# Altium project MG_V4(1).PrjPcb
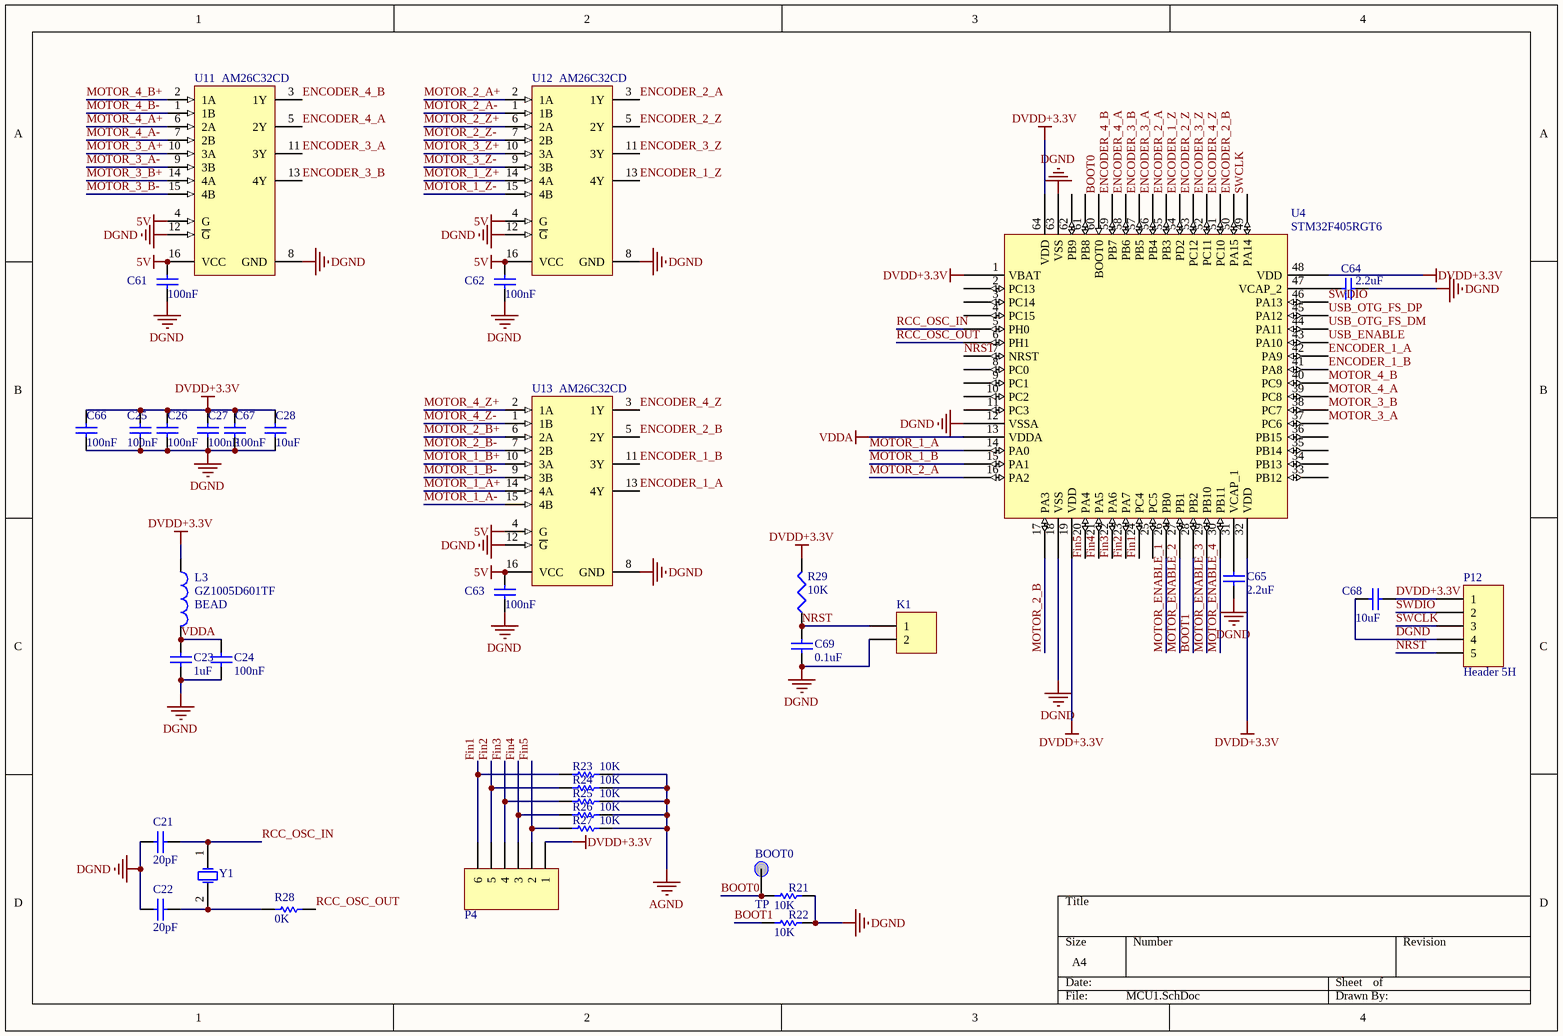
[diagram p0: MCU1.SchDoc]
3 sheets, 89 parts. Net scope: global (net labels, ports and power ports of the same name join across sheets).
Board file: MG_V4(1).PcbDoc
Sheets:
  MCU1.SchDoc
  MotorDrive1.SchDoc
  PowerSupply1.SchDoc

## Sheet MCU1.SchDoc
size A4

### Parts
BOOT0  TP  [TestPort]
C21  20pF  [0402]
C22  20pF  [0402]
C23  1uF  [1608[0603]]
C24  100nF  [1608[0603]]
C25  100nF  [1608[0603]]
C26  100nF  [1608[0603]]
C27  100nF  [1608[0603]]
C28  10uF  [1608[0603]]
C61  100nF  [1608[0603]]
C62  100nF  [1608[0603]]
C63  100nF  [1608[0603]]
C64  2.2uF  [1608[0603]]
C65  2.2uF  [1608[0603]]
C66  100nF  [1608[0603]]
C67  100nF  [1608[0603]]
C68  10uF  [1608[0603]]
C69  0.1uF  [1608[0603]]
K1  Header 2  [Button]  (value not drawn)
L3  GZ1005D601TF  [0402-A]
P4  Header 6  [HDR1X6]  (value not drawn)
P12  Header 5H  [HDR1X5H]
R21  10K  [J1-0603]
R22  10K  [J1-0603]
R23  10K  [RES[0402]]
R24  10K  [RES[0402]]
R25  10K  [RES[0402]]
R26  10K  [RES[0402]]
R27  10K  [RES[0402]]
R28  0K  [J1-0603]
R29  10K  [J1-0603]
U4  STM32F405RGT6  [STM32F405RGT6]
U11  AM26C32CD  [D16_L]
U12  AM26C32CD  [D16_L]
U13  AM26C32CD  [D16_L]
Y1  XTAL  [Crystal_HCM49]  (value not drawn)

### Nets
5V: C61.2 C62.2 C63.2 U11.4(G) U11.16(VCC) U12.4(G) U12.16(VCC) U13.4(G) U13.16(VCC)
AGND: R23.2 R24.2 R25.2 R26.2 R27.2
DGND: C21.1 C22.1 C23.1 C24.1 C25.1 C26.1 C27.1 C28.1 C61.1 C62.1 C63.1 C64.2 C65.1 C66.1 C67.1 C68.1 C69.1 K1.2 P12.4 R21.2 R22.2 U4.12(VSSA) U4.18(VSS) U4.63(VSS) U11.8(GND) U11.12(~{G}) U12.8(GND) U12.12(~{G}) U13.8(GND) U13.12(~{G})
DVDD+3.3V: C25.2 C26.2 C27.2 C28.2 C66.2 C67.2 C68.2 L3.1 P4.1 P12.1 R29.2 U4.1(VBAT) U4.19(VDD) U4.32(VDD) U4.48(VDD) U4.64(VDD)
VDDA: C23.2 C24.2 L3.2 U4.13(VDDA)
BOOT0: BOOT0.0 R21.1 U4.60(BOOT0)
BOOT1: R22.1 U4.28(PB2)
ENCODER_1_A: U4.42(PA9) U13.13(4Y)
ENCODER_1_B: U4.41(PA8) U13.11(3Y)
ENCODER_1_Z: U4.54(PD2) U12.13(4Y)
ENCODER_2_A: U4.55(PB3) U12.3(1Y)
ENCODER_2_B: U4.50(PA15) U13.5(2Y)
ENCODER_2_Z: U4.53(PC12) U12.5(2Y)
ENCODER_3_A: U4.56(PB4) U11.11(3Y)
ENCODER_3_B: U4.57(PB5) U11.13(4Y)
ENCODER_3_Z: U4.52(PC11) U12.11(3Y)
ENCODER_4_A: U4.58(PB6) U11.5(2Y)
ENCODER_4_B: U4.59(PB7) U11.3(1Y)
ENCODER_4_Z: U4.51(PC10) U13.3(1Y)
Fin1: P4.6 R23.1 U4.24(PC4)
Fin2: P4.5 R24.1 U4.23(PA7)
Fin3: P4.4 R25.1 U4.22(PA6)
Fin4: P4.3 R26.1 U4.21(PA5)
Fin5: P4.2 R27.1 U4.20(PA4)
MOTOR_1_A: U4.14(PA0)
MOTOR_1_A+: U13.14(4A)
MOTOR_1_A-: U13.15(4B)
MOTOR_1_B: U4.15(PA1)
MOTOR_1_B+: U13.10(3A)
MOTOR_1_B-: U13.9(3B)
MOTOR_1_Z+: U12.14(4A)
MOTOR_1_Z-: U12.15(4B)
MOTOR_2_A: U4.16(PA2)
MOTOR_2_A+: U12.2(1A)
MOTOR_2_A-: U12.1(1B)
MOTOR_2_B: U4.17(PA3)
MOTOR_2_B+: U13.6(2A)
MOTOR_2_B-: U13.7(2B)
MOTOR_2_Z+: U12.6(2A)
MOTOR_2_Z-: U12.7(2B)
MOTOR_3_A: U4.37(PC6)
MOTOR_3_A+: U11.10(3A)
MOTOR_3_A-: U11.9(3B)
MOTOR_3_B: U4.38(PC7)
MOTOR_3_B+: U11.14(4A)
MOTOR_3_B-: U11.15(4B)
MOTOR_3_Z+: U12.10(3A)
MOTOR_3_Z-: U12.9(3B)
MOTOR_4_A: U4.39(PC8)
MOTOR_4_A+: U11.6(2A)
MOTOR_4_A-: U11.7(2B)
MOTOR_4_B: U4.40(PC9)
MOTOR_4_B+: U11.2(1A)
MOTOR_4_B-: U11.1(1B)
MOTOR_4_Z+: U13.2(1A)
MOTOR_4_Z-: U13.1(1B)
MOTOR_ENABLE_1: U4.26(PB0)
MOTOR_ENABLE_2: U4.27(PB1)
MOTOR_ENABLE_3: U4.29(PB10)
MOTOR_ENABLE_4: U4.30(PB11)
NRST: C69.2 K1.1 P12.5 R29.1 U4.7(NRST)
RCC_OSC_IN: C21.2 U4.5(PH0) Y1.1(OSC1)
RCC_OSC_OUT: R28.2 U4.6(PH1)
SWCLK: P12.3 U4.49(PA14)
SWDIO: P12.2 U4.46(PA13)
USB_ENABLE: U4.43(PA10)
USB_OTG_FS_DM: U4.44(PA11)
USB_OTG_FS_DP: U4.45(PA12)
NetC22_2: C22.2 R28.1 Y1.2(OSC2)
NetC64_1: C64.1 U4.47(VCAP_2)
NetC65_2: C65.2 U4.31(VCAP_1)

Not connected (* = marked no-connect by the designer): U4 2(PC13) 3(PC14) 4(PC15) 8(PC0) 9(PC1) 10(PC2) 11(PC3) 25(PC5) 33(PB12) 34(PB13) 35(PB14) 36(PB15) 61(PB8) 62(PB9)

### Notes on the sheet
- (near L3) BEAD

### Library data of the parts
BOOT0 = TestPoint
C21-C28 C61-C69 = Cap: Capacitor; Published: 8-Jun-2000; LatestRevisionDate: 17-Jul-2002; LatestRevisionNote: Re-released for DXP Platform.; PackageReference: RAD-0.3; Publisher: Altium Limited; PackageDescription: Radial Cap, Thru-Hole; 2 Leads; 0.3 in Pin Spacing
  C21 C22: Value: 20pF
  C23: Value: 1uF
  C24-C27 C61-C63 C66 C67: Value: 100nF
  C28 C68: Value: 10uF
  C64 C65: Value: 2.2uF
  C69: Value: 0.1uF
K1 = Header 2: Header, 2-Pin; LatestRevisionDate: 17-Jul-2002; LatestRevisionNote: Re-released for DXP Platform.; Publisher: Altium Limited
L3 = Inductor: Code_IEC: 1005; Published: 8-Jun-2000; LatestRevisionDate: 29-May-2009; LatestRevisionNote: IPC-7351 Footprint Added.; PackageReference: 0402-A; Publisher: Altium Limited; PackageDescription: Chip Inductor; Code_JEITA: 0402
P4 = Header 6: Header, 6-Pin; LatestRevisionDate: 17-Jul-2002; LatestRevisionNote: Re-released for DXP Platform.; Publisher: Altium Limited
P12 = Header 5H: Header, 5-Pin, Right Angle; LatestRevisionDate: 17-Jul-2002; LatestRevisionNote: Re-released for DXP Platform.; Publisher: Altium Limited
R21-R28 = Res1: Resistor; Published: 8-Jun-2000; LatestRevisionDate: 17-Jul-2002; LatestRevisionNote: Re-released for DXP Platform.; PackageReference: AXIAL-0.3; Publisher: Altium Limited; PackageDescription: Axial Device, Thru-Hole; 2 Leads; 0.3 in Pin Spacing
  R21-R27: Value: 10K
  R28: Value: 0K
R29 = Res3: Resistor; Published: 8-Jun-2000; LatestRevisionDate: 29-May-2009; LatestRevisionNote: IPC-7351 Footprint Added.; PackageReference: J1-0603; Publisher: Altium Limited; PackageDescription: Chip Resistor; Value: 10K
U4 = STM32F405RGT6: IC MCU 32BIT 1MB FLASH 64LQFP
U11-U13 = AM26C32CD: Quadruple Differential Line Receiver, 0 TX / 4 RX, 5V, 0 to 70 degC, 16-Pin SOIC(D), Green (RoHS & no Sb/Br); Manufacturer: Texas Instruments; SubFamily: RS-422; Receivers Per Package: 4; ICC(Max)(mA): 15; Supply Voltage(s)(V): 5; ESD(kV): 2; Rating: Catalog; DatasheetVersion: SLLS104I; PackageVersion: revM, Jun-2011; PackageReference: D16; PackageDescription: 16-Pin Plastic Small Outline Integrated Circuit, 9.9 x 3.9 mm, Pitch 1.27 mm Pitch; PartNumber: AM26C32CD; Mounting Technology: Surface Mount; Eco-Plan: Green (RoHS & no Sb/Br); # of TX/RX: 0 TX / 4 RX; Footprint: AM26LS32; Code_JEDEC: MS-012AC; ComponentLink1Description: Datasheet; ComponentLink1URL: http://www.ti.com/general/docs/lit/getliterature.tsp?genericPartNumber=AM26C32&fileType=pdf; ComponentLink2Description: Package Specification; ComponentLink2URL: http://www.ti.com/litv/pdf/mpds178g
Y1 = XTAL: Crystal Oscillator; Published: 8-Jun-2000; LatestRevisionDate: 17-Jul-2002; LatestRevisionNote: Re-released for DXP Platform.; PackageReference: R38; Publisher: Altium Limited; PackageDescription: Crystal, Thru-Hole; 2 Leads; Body 3.1 x 8.2 mm (Dia.xH)

## Sheet MotorDrive1.SchDoc
size A4
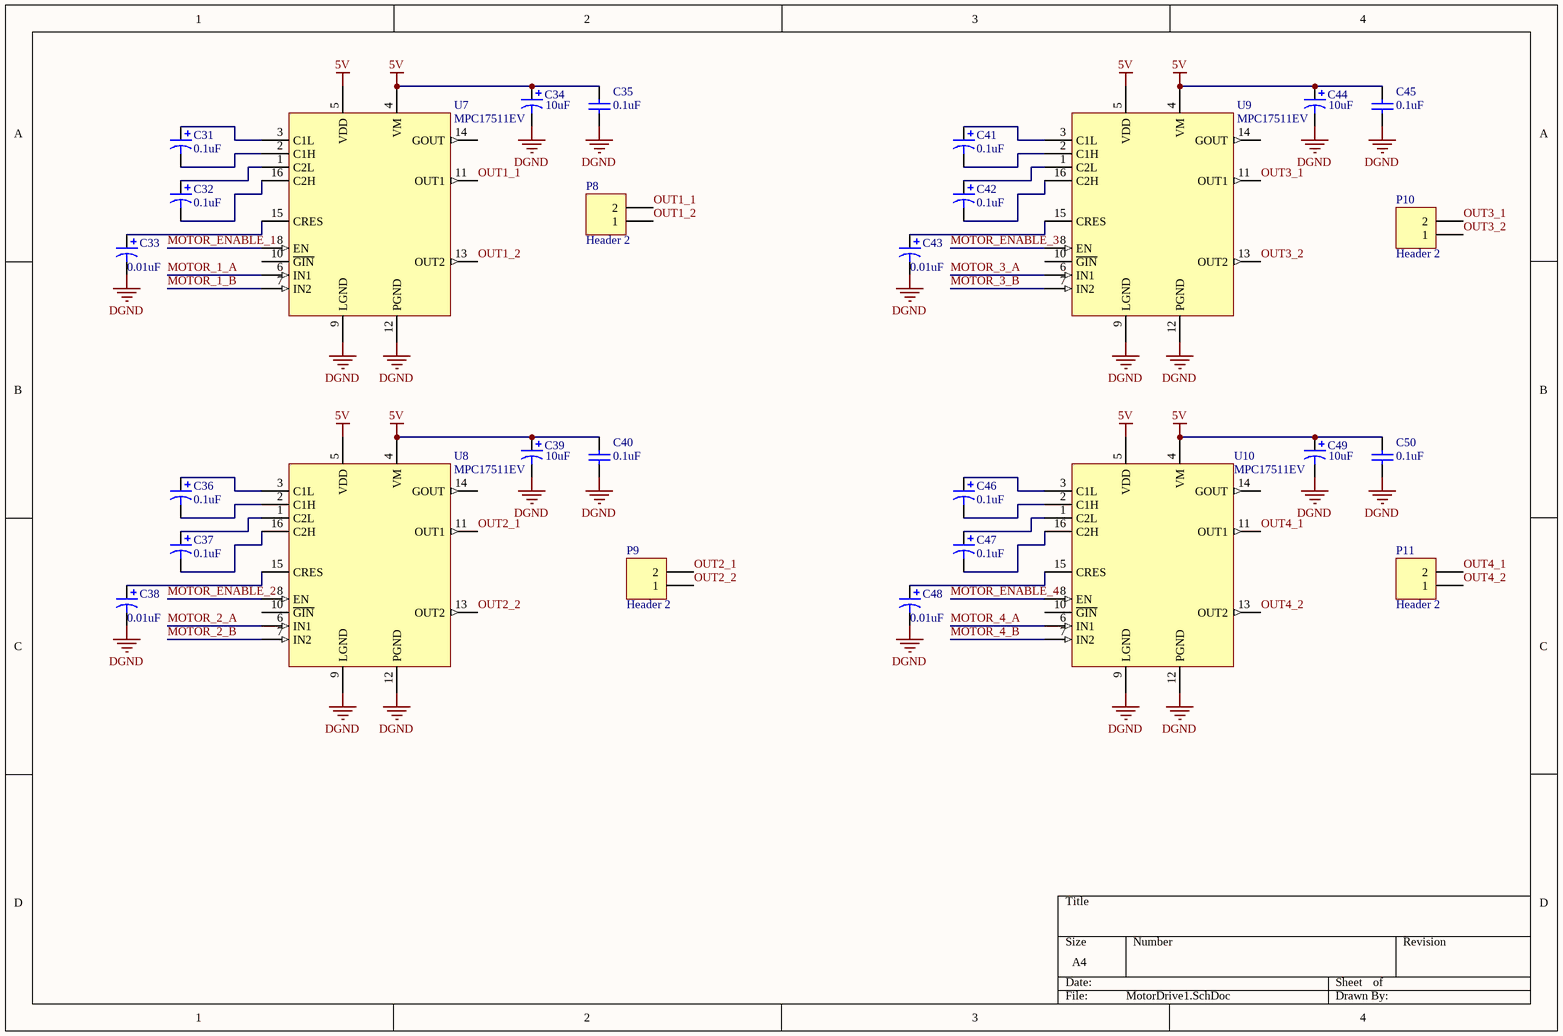
[diagram p1: MotorDrive1.SchDoc]

### Parts
C31  0.1uF  [0402]
C32  0.1uF  [0402]
C33  0.01uF  [1608[0603]]
C34  10uF  [1608[0603]]
C35  0.1uF  [1608[0603]]
C36  0.1uF  [0402]
C37  0.1uF  [0402]
C38  0.01uF  [1608[0603]]
C39  10uF  [1608[0603]]
C40  0.1uF  [1608[0603]]
C41  0.1uF  [0402]
C42  0.1uF  [0402]
C43  0.01uF  [1608[0603]]
C44  10uF  [1608[0603]]
C45  0.1uF  [1608[0603]]
C46  0.1uF  [0402]
C47  0.1uF  [0402]
C48  0.01uF  [1608[0603]]
C49  10uF  [1608[0603]]
C50  0.1uF  [1608[0603]]
P8  Header 2  [HDR1X2]
P9  Header 2  [HDR1X2]
P10  Header 2  [HDR1X2]
P11  Header 2  [HDR1X2]
U7  MPC17511EV  [MPC_motor_drive]
U8  MPC17511EV  [MPC_motor_drive]
U9  MPC17511EV  [MPC_motor_drive]
U10  MPC17511EV  [MPC_motor_drive]

### Nets
5V: C34.1 C35.2 C39.1 C40.2 C44.1 C45.2 C49.1 C50.2 U7.4(VM) U7.5(VDD) U8.4(VM) U8.5(VDD) U9.4(VM) U9.5(VDD) U10.4(VM) U10.5(VDD)
DGND: C33.2 C34.2 C35.1 C38.2 C39.2 C40.1 C43.2 C44.2 C45.1 C48.2 C49.2 C50.1 U7.9(LGND) U7.12(PGND) U8.9(LGND) U8.12(PGND) U9.9(LGND) U9.12(PGND) U10.9(LGND) U10.12(PGND)
MOTOR_1_A: U7.6(IN1)
MOTOR_1_B: U7.7(IN2)
MOTOR_2_A: U8.6(IN1)
MOTOR_2_B: U8.7(IN2)
MOTOR_3_A: U9.6(IN1)
MOTOR_3_B: U9.7(IN2)
MOTOR_4_A: U10.6(IN1)
MOTOR_4_B: U10.7(IN2)
MOTOR_ENABLE_1: U7.8(EN)
MOTOR_ENABLE_2: U8.8(EN)
MOTOR_ENABLE_3: U9.8(EN)
MOTOR_ENABLE_4: U10.8(EN)
OUT1_1: P8.2 U7.11(OUT1)
OUT1_2: P8.1 U7.13(OUT2)
OUT2_1: P9.2 U8.11(OUT1)
OUT2_2: P9.1 U8.13(OUT2)
OUT3_1: P10.2 U9.11(OUT1)
OUT3_2: P10.1 U9.13(OUT2)
OUT4_1: P11.2 U10.11(OUT1)
OUT4_2: P11.1 U10.13(OUT2)
NetC31_1: C31.1 U7.3(C1L)
NetC31_2: C31.2 U7.2(C1H)
NetC32_1: C32.1 U7.1(C2L)
NetC32_2: C32.2 U7.16(C2H)
NetC33_1: C33.1 U7.15(CRES)
NetC36_1: C36.1 U8.3(C1L)
NetC36_2: C36.2 U8.2(C1H)
NetC37_1: C37.1 U8.1(C2L)
NetC37_2: C37.2 U8.16(C2H)
NetC38_1: C38.1 U8.15(CRES)
NetC41_1: C41.1 U9.3(C1L)
NetC41_2: C41.2 U9.2(C1H)
NetC42_1: C42.1 U9.1(C2L)
NetC42_2: C42.2 U9.16(C2H)
NetC43_1: C43.1 U9.15(CRES)
NetC46_1: C46.1 U10.3(C1L)
NetC46_2: C46.2 U10.2(C1H)
NetC47_1: C47.1 U10.1(C2L)
NetC47_2: C47.2 U10.16(C2H)
NetC48_1: C48.1 U10.15(CRES)

Not connected (* = marked no-connect by the designer): U7 10(~{GIN}) 14(GOUT); U8 10(~{GIN}) 14(GOUT); U9 10(~{GIN}) 14(GOUT); U10 10(~{GIN}) 14(GOUT)

### Library data of the parts
C31-C34 C36-C39 C41-C44 C46-C49 = Cap Pol1: Polarized Capacitor (Radial); Published: 8-Jun-2000; LatestRevisionDate: 17-Jul-2002; LatestRevisionNote: Re-released for DXP Platform.; PackageReference: RB7.6-15; Publisher: Altium Limited; PackageDescription: Polarized Capacitor (Radial); 2 Leads
  C31 C32 C36 C37 C41 C42 C46 C47: Value: 0.1uF
  C33 C38 C43 C48: Value: 0.01uF
  C34 C39 C44 C49: Value: 10uF
C35 C40 C45 C50 = Cap: Capacitor; Published: 8-Jun-2000; LatestRevisionDate: 17-Jul-2002; LatestRevisionNote: Re-released for DXP Platform.; PackageReference: RAD-0.3; Publisher: Altium Limited; PackageDescription: Radial Cap, Thru-Hole; 2 Leads; 0.3 in Pin Spacing; Value: 0.1uF
P8-P11 = Header 2: Header, 2-Pin; LatestRevisionDate: 17-Jul-2002; LatestRevisionNote: Re-released for DXP Platform.; Publisher: Altium Limited
U7-U10 = MPC17511EV: IC MOTOR DRIVER PAR 16VMFP; Mfr 1: NXP USA; Mfr 1 PN: MPC17511EV; Notes: *

## Sheet PowerSupply1.SchDoc
size A4
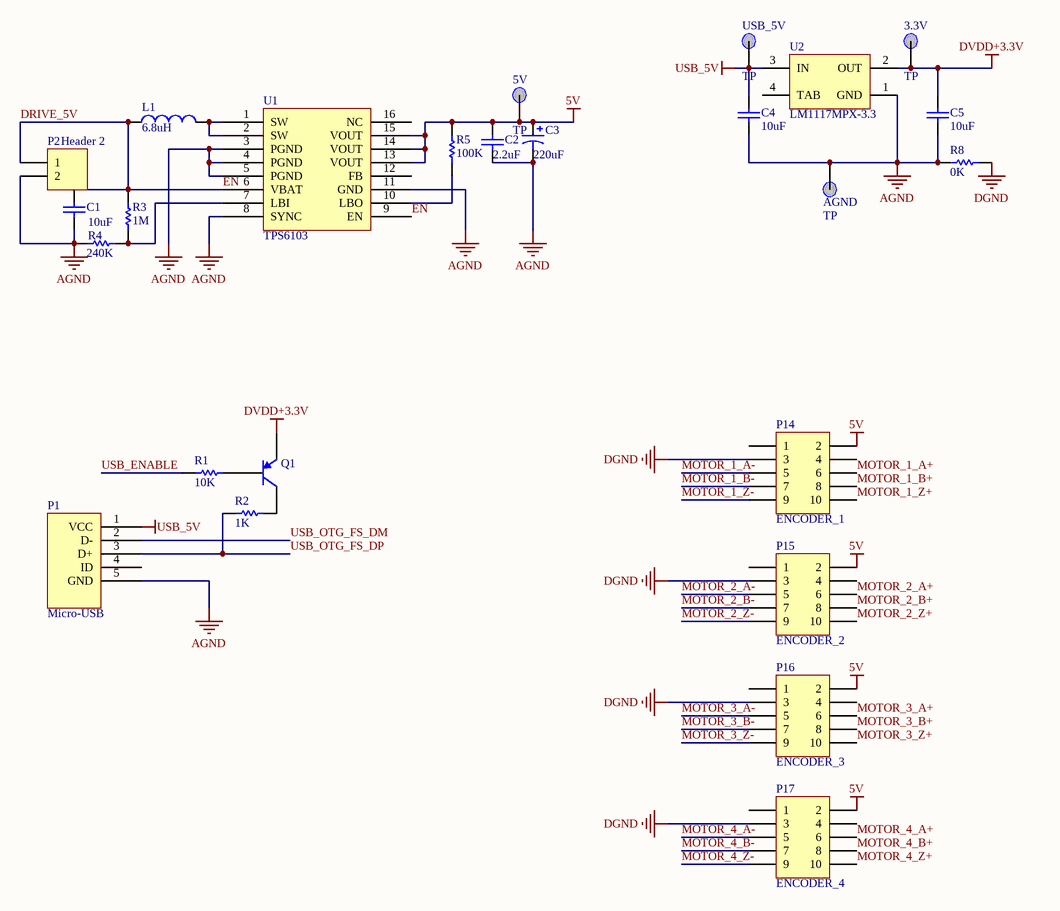
[diagram p2: PowerSupply1.SchDoc]

### Parts
3.3V  TP  [TestPort]
5V  TP  [TestPort]
AGND  TP  [TestPort]
C1  10uF  [1608[0603]]
C2  2.2uF  [1608[0603]]
C3  220uF  [6TPF220M5L]
C4  10uF  [1608[0603]]
C5  10uF  [1608[0603]]
L1  6.8uH  [B82464G4682M]
P1  Micro-USB  [Micro-USB]
P2  Header 2  [HDR1X2]
P14  ENCODER_1  [MHDR2X5]
P15  ENCODER_2  [MHDR2X5]
P16  ENCODER_3  [MHDR2X5]
P17  ENCODER_4  [MHDR2X5]
Q1  PNP  [SOT-23B_N]  (value not drawn)
R1  10K  [J1-0603]
R2  1K  [RES[0402]]
R3  1M  [J1-0603]
R4  240K  [J1-0603]
R5  100K  [J1-0603]
R8  0K  [J1-0603]
U1  TPS6103  [TI_PWP_G16]
U2  LM1117MPX-3.3  [SOT230-4N]
USB_5V  TP  [TestPort]

### Nets
5V: 5V.0 C2.2 C3.1 P14.2 P15.2 P16.2 P17.2 R5.2 U1.13(VOUT) U1.14(VOUT) U1.15(VOUT)
AGND: AGND.0 C1.1 C2.1 C3.2 C4.2 C5.2 P1.5(GND) P2.2 R4.1 R8.1 U1.3(PGND) U1.4(PGND) U1.5(PGND) U1.8(SYNC) U1.11(GND) U2.1(GND)
DGND: P14.3 P15.3 P16.3 P17.3 R8.2
DVDD+3.3V: 3.3V.0 C5.1 Q1.3(E) U2.2(OUT)
USB_5V: C4.1 P1.1(VCC) U2.3(IN) USB_5V.0
DRIVE_5V: C1.2 L1.1 P2.1 R3.2 U1.6(VBAT) U1.9(EN)  [also labelled EN]
MOTOR_1_A+: P14.6
MOTOR_1_A-: P14.5
MOTOR_1_B+: P14.8
MOTOR_1_B-: P14.7
MOTOR_1_Z+: P14.10
MOTOR_1_Z-: P14.9
MOTOR_2_A+: P15.6
MOTOR_2_A-: P15.5
MOTOR_2_B+: P15.8
MOTOR_2_B-: P15.7
MOTOR_2_Z+: P15.10
MOTOR_2_Z-: P15.9
MOTOR_3_A+: P16.6
MOTOR_3_A-: P16.5
MOTOR_3_B+: P16.8
MOTOR_3_B-: P16.7
MOTOR_3_Z+: P16.10
MOTOR_3_Z-: P16.9
MOTOR_4_A+: P17.6
MOTOR_4_A-: P17.5
MOTOR_4_B+: P17.8
MOTOR_4_B-: P17.7
MOTOR_4_Z+: P17.10
MOTOR_4_Z-: P17.9
USB_ENABLE: R1.1
USB_OTG_FS_DM: P1.2(D-)
USB_OTG_FS_DP: P1.3(D+) R2.2
NetL1_2: L1.2 U1.1(SW) U1.2(SW)
NetQ1_1: Q1.1(C) R2.1
NetQ1_2: Q1.2(B) R1.2
NetR3_1: R3.1 R4.2 U1.7(LBI)
NetR5_1: R5.1 U1.10(LBO)

Not connected (* = marked no-connect by the designer): P1 4(ID); P14 1 4; P15 1 4; P16 1 4; P17 1 4; U1 12(FB) 16(NC); U2 4(TAB)

### Library data of the parts
3.3V 5V AGND USB_5V = TestPoint
C1 C2 C4 C5 = Cap: Capacitor; Published: 8-Jun-2000; LatestRevisionDate: 17-Jul-2002; LatestRevisionNote: Re-released for DXP Platform.; PackageReference: RAD-0.3; Publisher: Altium Limited; PackageDescription: Radial Cap, Thru-Hole; 2 Leads; 0.3 in Pin Spacing
  C1 C4 C5: Value: 10uF
  C2: Value: 2.2uF
C3 = Cap Pol1: Polarized Capacitor (Radial); Published: 8-Jun-2000; LatestRevisionDate: 17-Jul-2002; LatestRevisionNote: Re-released for DXP Platform.; PackageReference: RB7.6-15; Publisher: Altium Limited; PackageDescription: Polarized Capacitor (Radial); 2 Leads; Value: 220uF
L1 = Inductor: Code_IEC: 1005; Published: 8-Jun-2000; LatestRevisionDate: 29-May-2009; LatestRevisionNote: IPC-7351 Footprint Added.; PackageReference: 0402-A; Publisher: Altium Limited; PackageDescription: Chip Inductor; Code_JEITA: 0402; Value: 6.8uH
P2 = Header 2: Header, 2-Pin; LatestRevisionDate: 17-Jul-2002; LatestRevisionNote: Re-released for DXP Platform.; Publisher: Altium Limited
P14-P17 = Header 5X2: Header, 5-Pin, Dual row; LatestRevisionDate: 17-Jul-2002; LatestRevisionNote: Re-released for DXP Platform.; Publisher: Altium Limited
Q1 = PNP: PNP Bipolar Transistor; Published: 8-Jun-2000; LatestRevisionDate: 29-May-2009; LatestRevisionNote: IPC-7351 Footprint Added.; PackageVersion: Aug-1999; PackageReference: SOT-23B; Publisher: Altium Limited; PackageDescription: 3-Pin SOT-23 Package 0.95 mm Pitch, 2.4 mm Lead Span
R1-R5 R8 = Res1: Resistor; Published: 8-Jun-2000; LatestRevisionDate: 17-Jul-2002; LatestRevisionNote: Re-released for DXP Platform.; PackageReference: AXIAL-0.3; Publisher: Altium Limited; PackageDescription: Axial Device, Thru-Hole; 2 Leads; 0.3 in Pin Spacing
  R1: Value: 10K
  R2: Value: 1K
  R3: Value: 1M
  R4: Value: 240K
  R5: Value: 100K
  R8: Value: 0K
U2 = LM1117MPX-3.3: 800mA Low-Dropout Linear Regulator, 4-pin SOT-223; Manufacturer: National Semiconductor; PackageTopMarking: XYTT*N05A; PowerWise: N; CompType: LDO IC; Published: 1-Mar-2010; DatasheetVersion: Apr-2006; PackageVersion: revB, Apr-2003; PackageReference: MP04A; Publisher: Altium Limited; PackageDescription: Molded SOT-223, 6.50 x 3.56 x 1.6mm Body, 4 Lead, 2.3mm Pitch; Supplier 1: Farnell; Supplier Part Number 1: 1652313; PartNumber: LM1117MPX-3.3; RoHS: N; PinCount: 4; Code_JEDEC: TO-261-AA; Code_IPC: SOT223-4; ComponentLink1Description: LM1117 Datasheet; ComponentLink1URL: http://www.national.com/ds/LM/LM1117.pdf; ComponentLink2Description: LM1117 Web Page; ComponentLink2URL: http://www.national.com/pf/LM/LM1117.html; ComponentLink3Description: MP04A Package Page; ComponentLink3URL: http://www.national.com/packaging/folders/mp04a.html

## Nets that join several sheets
5V: MCU1 (9 pins), MotorDrive1 (16 pins), PowerSupply1 (11 pins)
AGND: MCU1 (5 pins), PowerSupply1 (16 pins)
DGND: MCU1 (30 pins), MotorDrive1 (20 pins), PowerSupply1 (5 pins)
DVDD+3.3V: MCU1 (16 pins), PowerSupply1 (3.3V.0 C5.1 Q1.3 U2.2)
MOTOR_1_A: MCU1 (U4.14), MotorDrive1 (U7.6)
MOTOR_1_A+: MCU1 (U13.14), PowerSupply1 (P14.6)
MOTOR_1_A-: MCU1 (U13.15), PowerSupply1 (P14.5)
MOTOR_1_B: MCU1 (U4.15), MotorDrive1 (U7.7)
MOTOR_1_B+: MCU1 (U13.10), PowerSupply1 (P14.8)
MOTOR_1_B-: MCU1 (U13.9), PowerSupply1 (P14.7)
MOTOR_1_Z+: MCU1 (U12.14), PowerSupply1 (P14.10)
MOTOR_1_Z-: MCU1 (U12.15), PowerSupply1 (P14.9)
MOTOR_2_A: MCU1 (U4.16), MotorDrive1 (U8.6)
MOTOR_2_A+: MCU1 (U12.2), PowerSupply1 (P15.6)
MOTOR_2_A-: MCU1 (U12.1), PowerSupply1 (P15.5)
MOTOR_2_B: MCU1 (U4.17), MotorDrive1 (U8.7)
MOTOR_2_B+: MCU1 (U13.6), PowerSupply1 (P15.8)
MOTOR_2_B-: MCU1 (U13.7), PowerSupply1 (P15.7)
MOTOR_2_Z+: MCU1 (U12.6), PowerSupply1 (P15.10)
MOTOR_2_Z-: MCU1 (U12.7), PowerSupply1 (P15.9)
MOTOR_3_A: MCU1 (U4.37), MotorDrive1 (U9.6)
MOTOR_3_A+: MCU1 (U11.10), PowerSupply1 (P16.6)
MOTOR_3_A-: MCU1 (U11.9), PowerSupply1 (P16.5)
MOTOR_3_B: MCU1 (U4.38), MotorDrive1 (U9.7)
MOTOR_3_B+: MCU1 (U11.14), PowerSupply1 (P16.8)
MOTOR_3_B-: MCU1 (U11.15), PowerSupply1 (P16.7)
MOTOR_3_Z+: MCU1 (U12.10), PowerSupply1 (P16.10)
MOTOR_3_Z-: MCU1 (U12.9), PowerSupply1 (P16.9)
MOTOR_4_A: MCU1 (U4.39), MotorDrive1 (U10.6)
MOTOR_4_A+: MCU1 (U11.6), PowerSupply1 (P17.6)
MOTOR_4_A-: MCU1 (U11.7), PowerSupply1 (P17.5)
MOTOR_4_B: MCU1 (U4.40), MotorDrive1 (U10.7)
MOTOR_4_B+: MCU1 (U11.2), PowerSupply1 (P17.8)
MOTOR_4_B-: MCU1 (U11.1), PowerSupply1 (P17.7)
MOTOR_4_Z+: MCU1 (U13.2), PowerSupply1 (P17.10)
MOTOR_4_Z-: MCU1 (U13.1), PowerSupply1 (P17.9)
MOTOR_ENABLE_1: MCU1 (U4.26), MotorDrive1 (U7.8)
MOTOR_ENABLE_2: MCU1 (U4.27), MotorDrive1 (U8.8)
MOTOR_ENABLE_3: MCU1 (U4.29), MotorDrive1 (U9.8)
MOTOR_ENABLE_4: MCU1 (U4.30), MotorDrive1 (U10.8)
USB_ENABLE: MCU1 (U4.43), PowerSupply1 (R1.1)
USB_OTG_FS_DM: MCU1 (U4.44), PowerSupply1 (P1.2)
USB_OTG_FS_DP: MCU1 (U4.45), PowerSupply1 (P1.3 R2.2)